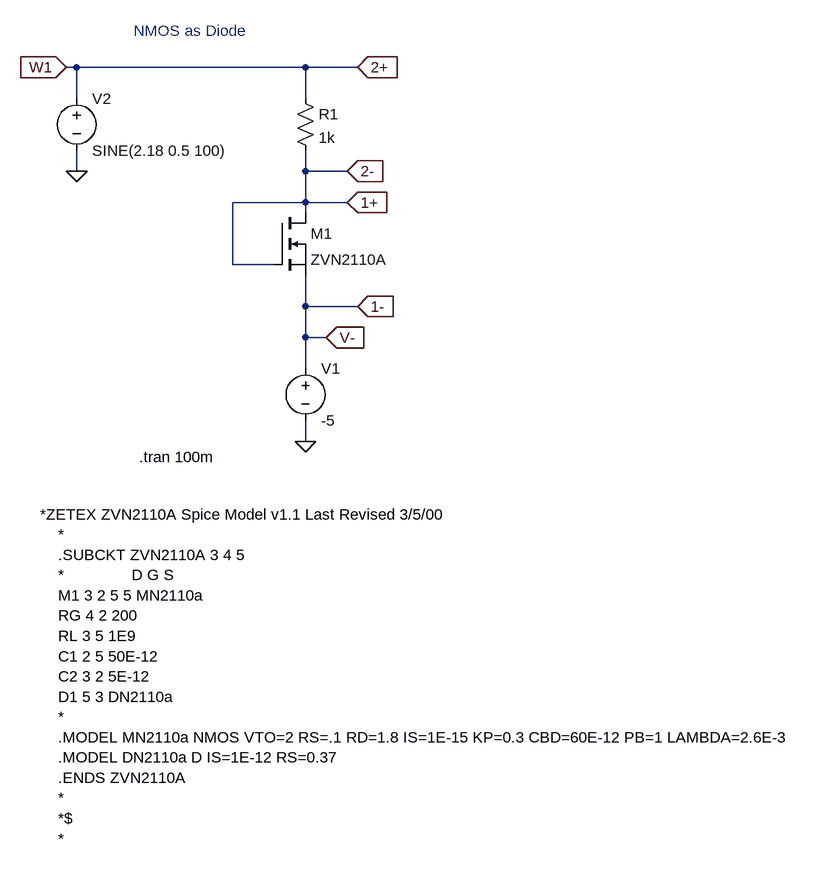
[diagram p0: schematic nmos_diode.asc]
nmos_diode.asc, the LTspice schematic file:
Version 4
SHEET 1 920 960
WIRE -144 -96 -160 -96
WIRE 208 -96 -144 -96
WIRE 288 -96 208 -96
WIRE -144 -48 -144 -96
WIRE 208 -48 208 -96
WIRE -144 64 -144 32
WIRE 208 64 208 32
WIRE 272 64 208 64
WIRE 208 112 208 64
WIRE 208 112 96 112
WIRE 272 112 208 112
WIRE 208 128 208 112
WIRE 96 208 96 112
WIRE 160 208 96 208
WIRE 208 272 208 224
WIRE 288 272 208 272
WIRE 208 320 208 272
WIRE 240 320 208 320
WIRE 208 368 208 320
WIRE 208 480 208 448
FLAG 208 480 0
FLAG 240 320 V-
IOPIN 240 320 In
FLAG 288 272 1-
IOPIN 288 272 In
FLAG 272 64 2-
IOPIN 272 64 In
FLAG 272 112 1+
IOPIN 272 112 In
FLAG -144 64 0
FLAG -160 -96 W1
IOPIN -160 -96 In
FLAG 288 -96 2+
IOPIN 288 -96 In
SYMBOL nmos 160 128 R0
SYMATTR InstName M1
SYMATTR Value ZVN2110A
SYMATTR Prefix X
SYMBOL res 192 -64 R0
SYMATTR InstName R1
SYMATTR Value 1k
SYMBOL voltage 208 352 R0
WINDOW 123 0 0 Left 0
WINDOW 39 0 0 Left 0
SYMATTR InstName V1
SYMATTR Value -5
SYMBOL voltage -144 -64 R0
WINDOW 123 0 0 Left 0
WINDOW 39 0 0 Left 0
SYMATTR InstName V2
SYMATTR Value SINE(2.18 0.5 100)
TEXT -48 504 Left 2 !.tran 100m
TEXT -56 -152 Left 2 ;NMOS as Diode
TEXT -200 592 Left 2 !*ZETEX ZVN2110A Spice Model v1.1 Last Revised 3/5/00\n    *\n    .SUBCKT ZVN2110A 3 4 5\n    *               D G S\n    M1 3 2 5 5 MN2110a\n    RG 4 2 200\n    RL 3 5 1E9\n    C1 2 5 50E-12\n    C2 3 2 5E-12\n    D1 5 3 DN2110a\n    *\n    .MODEL MN2110a NMOS VTO=2 RS=.1 RD=1.8 IS=1E-15 KP=0.3 CBD=60E-12 PB=1 LAMBDA=2.6E-3\n    .MODEL DN2110a D IS=1E-12 RS=0.37\n    .ENDS ZVN2110A\n    *\n    *$\n    *

The netlist it stands for:
* nmos_diode.asc
XM1 1+ 1+ 1- ZVN2110A  ; pins D G S
R1 2+ 1+ 1k
V1 1- 0 -5
V2 2+ 0 SINE(2.18 0.5 100)
.tran 100m
* NMOS as Diode
*ZETEX ZVN2110A Spice Model v1.1 Last Revised 3/5/00
    *
    .SUBCKT ZVN2110A 3 4 5
    *               D G S
    M1 3 2 5 5 MN2110a
    RG 4 2 200
    RL 3 5 1E9
    C1 2 5 50E-12
    C2 3 2 5E-12
    D1 5 3 DN2110a
    *
    .MODEL MN2110a NMOS VTO=2 RS=.1 RD=1.8 IS=1E-15 KP=0.3 CBD=60E-12 PB=1 LAMBDA=2.6E-3
    .MODEL DN2110a D IS=1E-12 RS=0.37
    .ENDS ZVN2110A
    *
    *$
    *
.backanno
.end